# EAGLE design esp32programmer (EAGLE 9.5.2)
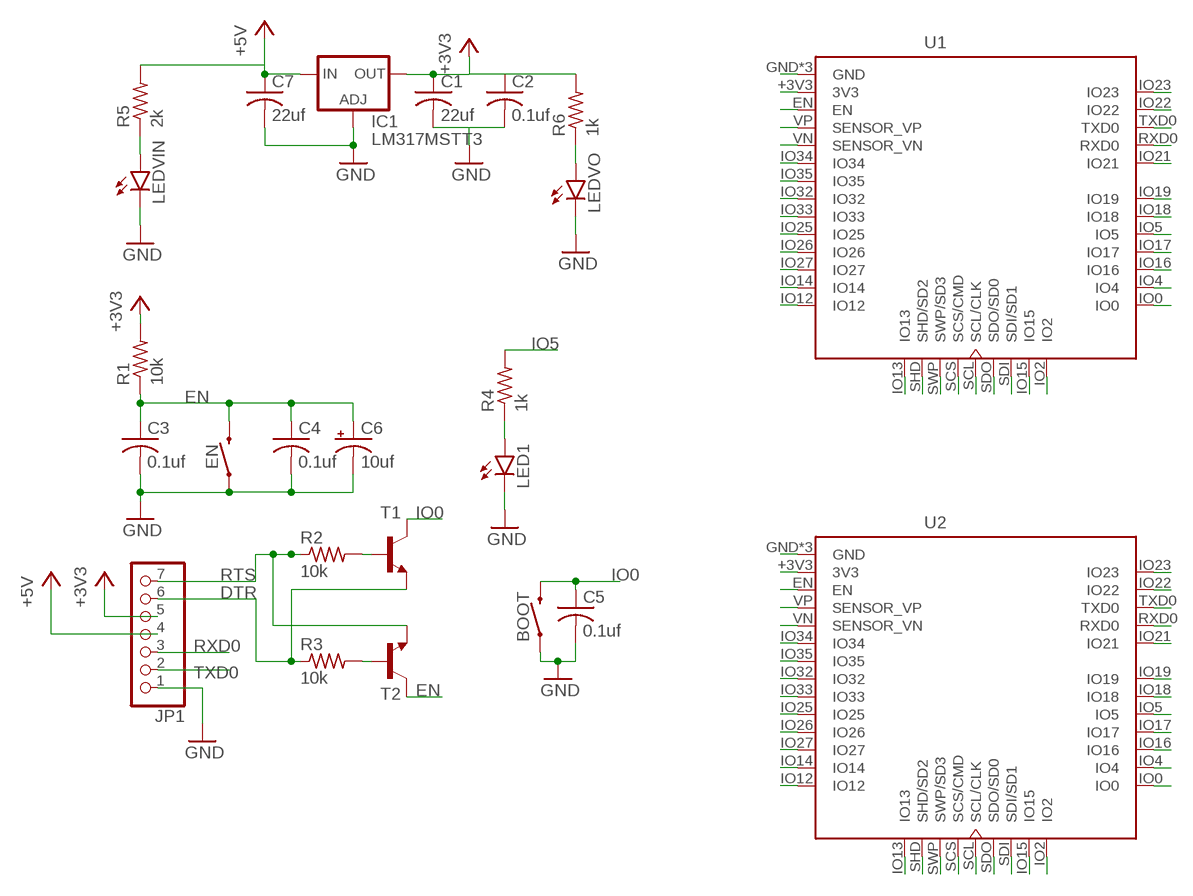
[diagram p0: schematic, sheet 1]

## Parts
BOOT  MOMENTARY-SWITCH-SPST-SMD-4.6X2.8MM  [TACTILE_SWITCH_SMD_4.6X2.8MM]
C1  22uf  C-USC1210  [C1210]
C2  0.1uf  C-USC0805  [C0805]
C3  0.1uf  C-USC0805  [C0805]
C4  0.1uf  C-USC0805  [C0805]
C5  0.1uf  C-USC0805  [C0805]
C6  10uf  CPOL-US153CLV-0605  [153CLV-0605]
C7  22uf  C-USC1210  [C1210]
EN  MOMENTARY-SWITCH-SPST-SMD-4.6X2.8MM  [TACTILE_SWITCH_SMD_4.6X2.8MM]
IC1  LM317MSTT3  [SOT223]
JP1  PINHD-1X7  [1X07]
LED1  LEDSML0805  [SML0805]
LEDVIN  LEDSML0805  [SML0805]
LEDVO  LEDSML0805  [SML0805]
R1  10k  R-US_R0805  [R0805]
R2  10k  R-US_M0805  [M0805]
R3  10k  R-US_M0805  [M0805]
R4  1k  R-US_R0805  [R0805]
R5  2k  R-US_R0805  [R0805]
R6  1k  R-US_R0805  [R0805]
T1  -NPN-SOT23-EBC  [SOT23-EBC]
T2  -NPN-SOT23-EBC  [SOT23-EBC]
U1  ESP32-32DADAPTOR  [ESP32_MODULE_ADAPTOR]
U2  ESP32-32DADAPTOR  [ESP32_MODULE_ADAPTOR]

## Nets
+3V3: C1.1 C2.1 IC1.4(OUT) JP1.5 R1.2 R6.2 U1.+3V3(3V3) U2.+3V3(3V3)
+5V: C7.1 IC1.3(IN) JP1.4 R5.2
DTR: JP1.6 R3.1 T1.E
EN: C3.1 C4.1 C6.+ EN.3 EN.4 R1.1 T2.C U1.EN U2.EN
GND: BOOT.1 BOOT.2 C1.2 C2.2 C3.2 C4.2 C5.2 C6.- C7.2 EN.1 EN.2 IC1.1(ADJ) JP1.1 LED1.C LEDVIN.C LEDVO.C U1.GND U1.GND@1(GND) U1.GND@3(GND) U2.GND U2.GND@1(GND) U2.GND@3(GND)
IO0: BOOT.3 BOOT.4 C5.1 T1.C U1.IO0 U2.IO0
IO2: U1.IO2 U2.IO2
IO4: U1.IO4 U2.IO4
IO5: R4.2 U1.IO5 U2.IO5
IO12: U1.IO12 U2.IO12
IO13: U1.IO13 U2.IO13
IO14: U1.IO14 U2.IO14
IO15: U1.IO15 U2.IO15
IO16: U1.IO16 U2.IO16
IO17: U1.IO17 U2.IO17
IO18: U1.IO18 U2.IO18
IO19: U1.IO19 U2.IO19
IO21: U1.IO21 U2.IO21
IO22: U1.IO22 U2.IO22
IO23: U1.IO23 U2.IO23
IO25: U1.IO25 U2.IO25
IO26: U1.IO26 U2.IO26
IO27: U1.IO27 U2.IO27
IO32: U1.IO32 U2.IO32
IO33: U1.IO33 U2.IO33
IO34: U1.IO34 U2.IO34
IO35: U1.IO35 U2.IO35
N$1: R2.2 T1.B
N$2: R3.2 T2.B
N$3: LED1.A R4.1
N$4: LEDVIN.A R5.1
N$5: LEDVO.A R6.1
RTS: JP1.7 R2.1 T2.E
RXD0: JP1.3 U1.RXD0 U2.RXD0
SCL: U1.SCL(SCL/CLK) U2.SCL(SCL/CLK)
SCS: U1.SCS(SCS/CMD) U2.SCS(SCS/CMD)
SDI: U1.SDI(SDI/SD1) U2.SDI(SDI/SD1)
SDO: U1.SDO(SDO/SD0) U2.SDO(SDO/SD0)
SHD: U1.SHD(SHD/SD2) U2.SHD(SHD/SD2)
SWP: U1.SWP(SWP/SD3) U2.SWP(SWP/SD3)
TXD0: JP1.2 U1.TXD0 U2.TXD0
VN: U1.VN(SENSOR_VN) U2.VN(SENSOR_VN)
VP: U1.VP(SENSOR_VP) U2.VP(SENSOR_VP)

## Library data of the parts
BOOT EN = SparkFun-Switches:MOMENTARY-SWITCH-SPST: Momentary Switch (Pushbutton) - SPST Normally-open (NO) SPST momentary switches (buttons, pushbuttons). Variants PTH-12MM - 12mm square, through-hole Momentary Pushbutton Switch - 12mm Square <https://www.sparkfun.com/products/9190> (COM-09190) PTH-6.0MM, PTH-6.0MM-KIT - 6.0mm square, through-hole Mini Pushbutton Switch <https://www.sparkfun.com/products/97> (COM-00097) KIT package intended for soldering kit's - only one side of pads' copper is exposed. PTH-RIGHT-ANGLE-KIT - Right-angle, through-hole Right Angle Tactile Button <https://www.sparkfun.com/products/10791> - Used on SparkFun BigTime Watch Kit <https://www.sparkfun.com/products/11734> SMD-12MM - 12mm square, surface-mount Tactile Button - SMD (12mm) <https://www.sparkfun.com/products/12993> (COM-12993) Used on SparkFun PicoBoard <https://www.sparkfun.com/products/11888> SMD-4.5MM - 4.5mm Square Trackball Switch Used on SparkFun Blackberry Trackballer Breakout <https://www.sparkfun.com/products/13169> SMD-4.6MMX2.8MM - 4.60mm x 2.80mm, surface mount Used on SparkFun SAMD21 Mini Breakout <https://www.sparkfun.com/products/13664> SMD-5.2MM, SMD-5.2-REDUNDANT - 5.2mm square, surface-mount Mini Pushbutton Switch - SMD <https://www.sparkfun.com/products/8720> (COM-08720) Used on Arduino Pro Mini <https://www.sparkfun.com/products/11114> REDUNDANT package connects both switch circuits together SMD-6.0X3.5MM - 6.0 x 3.5mm, surface mount Momentary Reset Switch SMD <https://www.sparkfun.com/products/8229> (COM-08229) SMD-6.2MM-TALL - 6.2mm square, surface mount Tactile Button - SMD (6mm) <https://www.sparkfun.com/products/12992> Used on SparkFun Digital Sandbox <https://www.sparkfun.com/products/12651> SMD-RIGHT-ANGLE - Right-angle, surface mount Used on SparkFun Block for Intel® Edison - Arduino <https://www.sparkfun.com/products/13036>; PROD_ID: SWCH-13065
C1-C5 C7 = rcl:C-US: CAPACITOR, American symbol; SPICEPREFIX: C
C6 = rcl:CPOL-US: POLARIZED CAPACITOR, American symbol; SPICEPREFIX: C
IC1 = v-reg:LM317?*: 500 mA Adjustable Output Positive Voltage Regulator Source: http://www.onsemi.co.jp .. LM317M-D.PDF
JP1 = pinhead:PINHD-1X7: PIN HEADER
LED1 LEDVIN LEDVO = led:LED: LED OSRAM: - CHIPLED LG R971, LG N971, LY N971, LG Q971, LY Q971, LO R971, LY R971 LH N974, LH R974 LS Q976, LO Q976, LY Q976 LO Q996 - Hyper CHIPLED LW Q18S LB Q993, LB Q99A, LB R99A - SideLED LS A670, LO A670, LY A670, LG A670, LP A670 LB A673, LV A673, LT A673, LW A673 LH A674 LY A675 LS A676, LA A676, LO A676, LY A676, LW A676 LS A679, LY A679, LG A679 - Hyper Micro SIDELED® LS Y876, LA Y876, LO Y876, LY Y876 LT Y87S - SmartLED LW L88C, LW L88S LB L89C, LB L89S, LG L890 LS L89K, LO L89K, LY L89K LS L896, LA L896, LO L896, LY L896 - TOPLED LS T670, LO T670, LY T670, LG T670, LP T670 LSG T670, LSP T670, LSY T670, LOP T670, LYG T670 LG T671, LOG T671, LSG T671 LB T673, LV T673, LT T673, LW T673 LH T674 LS T676, LA T676, LO T676, LY T676, LB T676, LH T676, LSB T676, LW T676 LB T67C, LV T67C, LT T67C, LS T67K, LO T67K, LY T67K, LW E67C LS E67B, LA E67B, LO E67B, LY E67B, LB E67C, LV E67C, LT E67C LW T67C LS T679, LY T679, LG T679 LS T770, LO T770, LY T770, LG T770, LP T770 LB T773, LV T773, LT T773, LW T773 LH T774 LS E675, LA E675, LY E675, LS T675 LS T776, LA T776, LO T776, LY T776, LB T776 LHGB T686 LT T68C, LB T68C - Hyper Mini TOPLED® LB M676 - Mini TOPLED Santana® LG M470 LS M47K, LO M47K, LY M47K Source: http://www.osram.convergy.de LUXEON: - LUMILED® LXK2-PW12-R00, LXK2-PW12-S00, LXK2-PW14-U00, LXK2-PW14-V00 LXK2-PM12-R00, LXK2-PM12-S00, LXK2-PM14-U00 LXK2-PE12-Q00, LXK2-PE12-R00, LXK2-PE12-S00, LXK2-PE14-T00, LXK2-PE14-U00 LXK2-PB12-K00, LXK2-PB12-L00, LXK2-PB12-M00, LXK2-PB14-N00, LXK2-PB14-P00, LXK2-PB14-Q00 LXK2-PR12-L00, LXK2-PR12-M00, LXK2-PR14-Q00, LXK2-PR14-R00 LXK2-PD12-Q00, LXK2-PD12-R00, LXK2-PD12-S00 LXK2-PH12-R00, LXK2-PH12-S00 LXK2-PL12-P00, LXK2-PL12-Q00, LXK2-PL12-R00 Source: www.luxeon.com KINGBRIGHT: KA-3528ASYC Source: www.kingbright.com
R1-R6 = rcl:R-US_: RESISTOR, American symbol; SPICEPREFIX: R
T1 T2 = transistor:*-NPN-: NPN Transistror BF959 corrected 2008.03.06
U1 U2 = CustomParts:ESP32-32D: IC: SoC; GPIO, I2C, I2S, IR, SD, SDIO, SPI, UART; 2.7÷3.6VDC; 20dBm

## Board
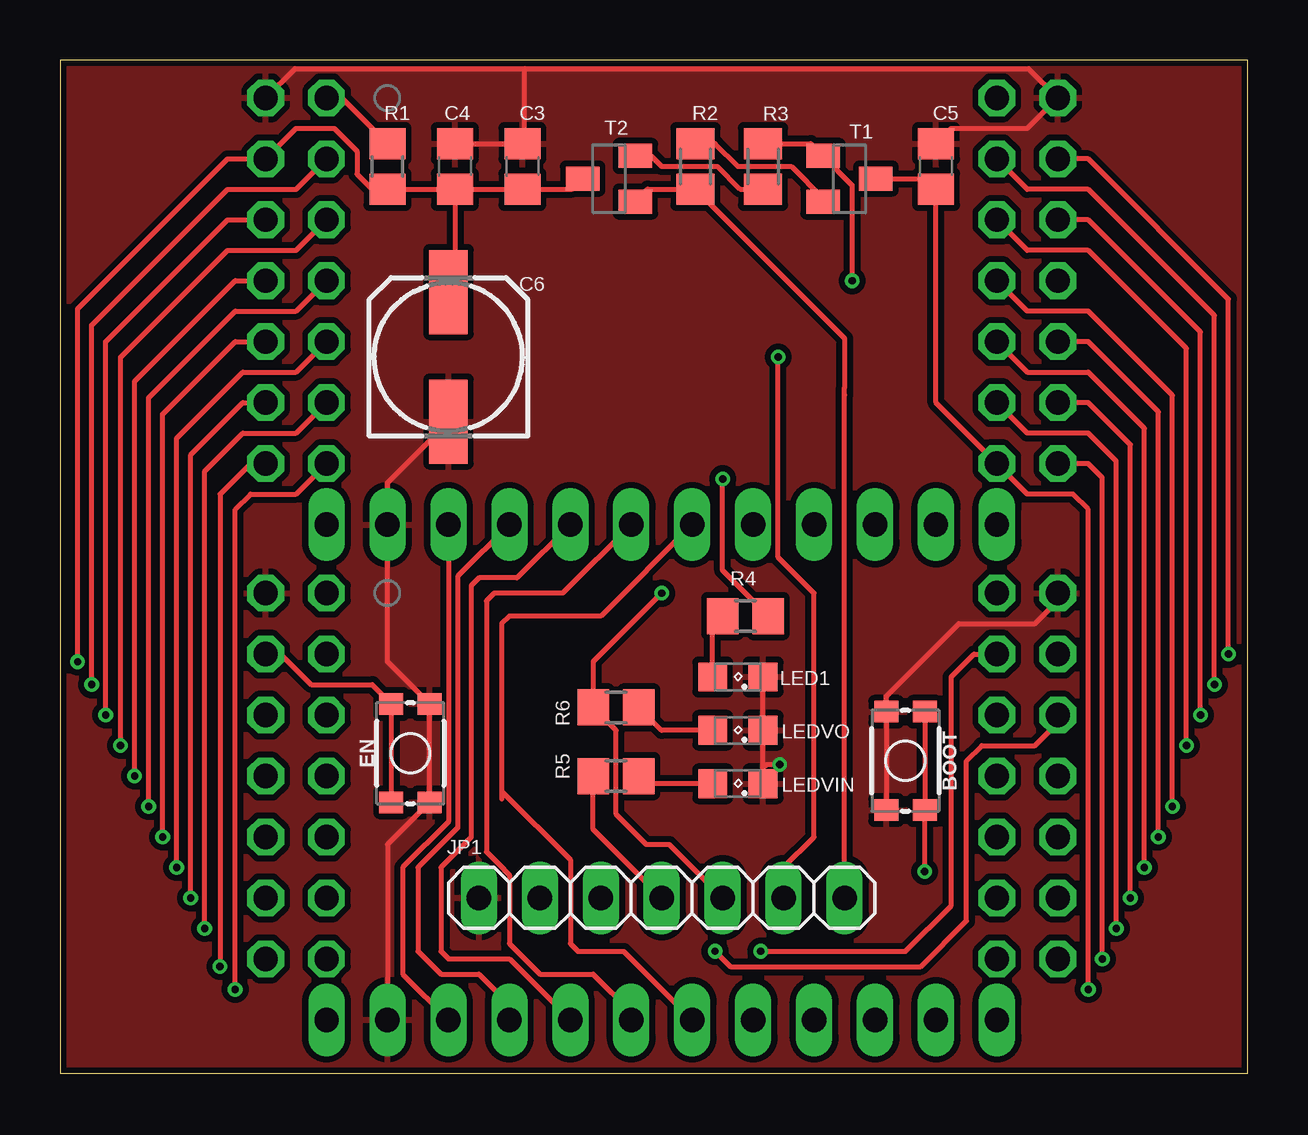
[diagram p1: board, top side]
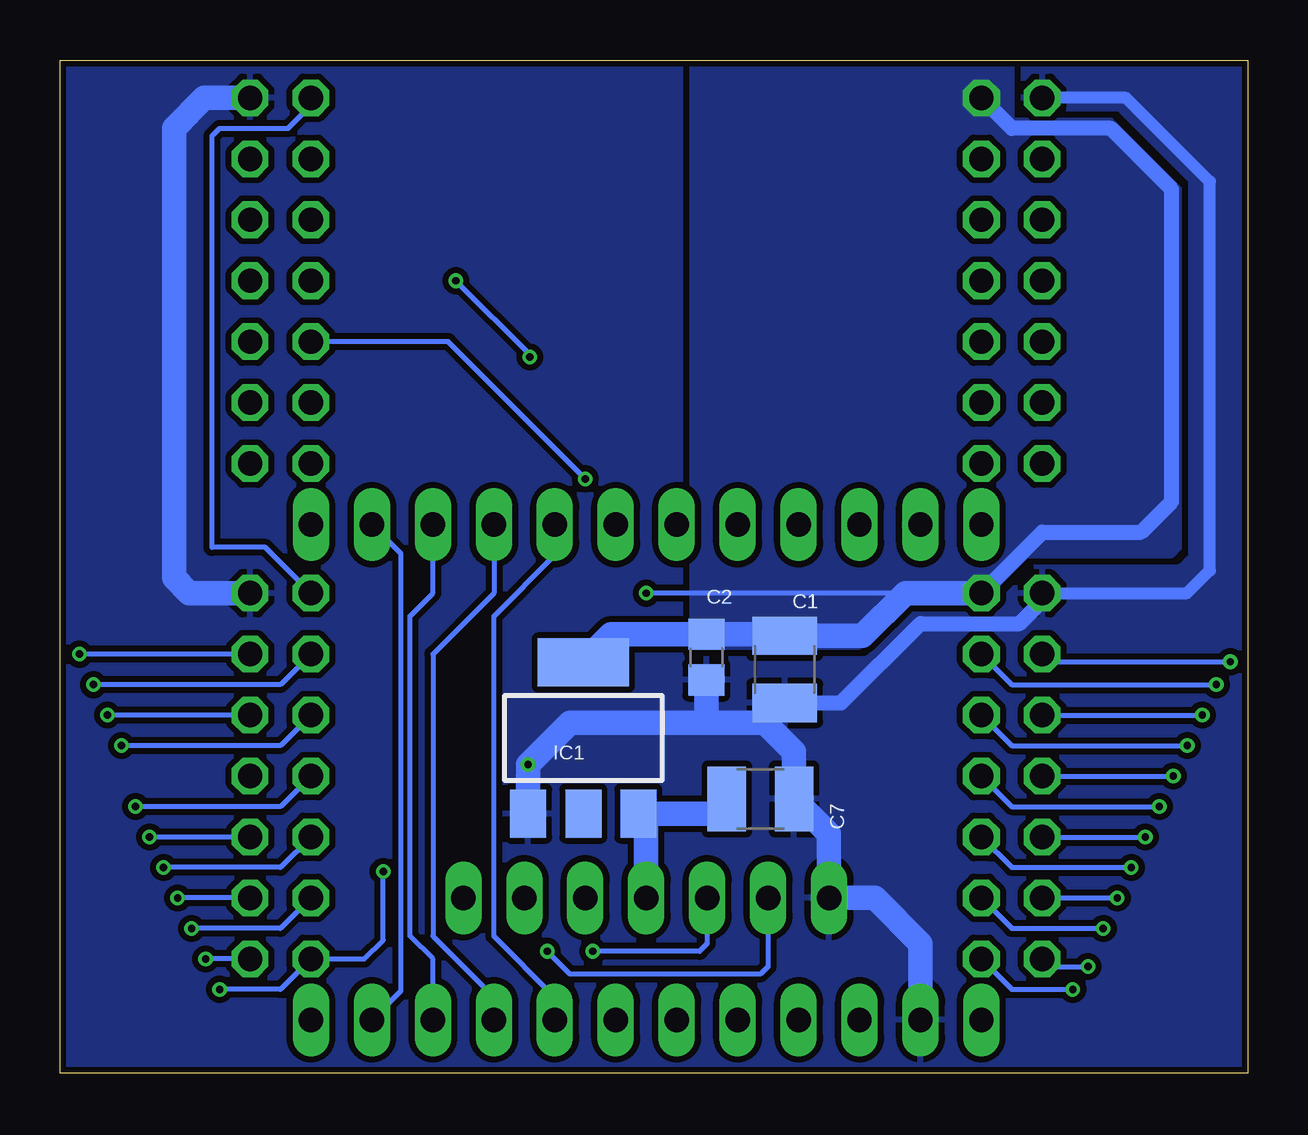
[diagram p2: board, bottom side, seen from below]

Size 49.52 x 42.22 mm. Coordinates in mm from the lower left corner, seen from the top.
Outline: 0,0 49.52,0 49.52,42.22 0,42.22 0,0
Copper layers (1*16): Top 0.035mm / dielectric 1.5mm / Bottom 0.035mm
Design rules "dirt_cheap_dirty_boards.v1.1 *": minimum track width 6mil, minimum drill 12mil, track to track 7mil, track to pad 7mil, pad to pad 7mil, via to via 7mil, smd to smd 0mil, copper to edge 10mil, drill to drill 10mil, minimum pad ring 10mil, minimum via ring 6mil, stop-mask expansion 2mil, vias tented up to drill 25mil, thermal gap 10mil

### Footprints (pad centres in the part's own frame; a part is rotated, then mirrored left to right if it is on the bottom)
TACTILE_SWITCH_SMD_4.6X2.8MM = smd 0.9 x 1: 1 -2.05,-0.8; 2 2.05,-0.8; 3 2.05,0.8; 4 -2.05,0.8
C1210 = smd 1.6 x 2.7: 1 -1.4,0; 2 1.4,0
C0805 = smd 1.3 x 1.5: 1 -0.95,0; 2 0.95,0
153CLV-0605 = smd 3.5 x 1.6: + 2.7,0; - -2.7,0
SOT223 = smd 1.5 x 2: 1 -2.3,-3.15; 2 0,-3.15; 3 2.3,-3.15 | smd 3.8 x 2: 4 0,3.15
1X07 = drill 1.016 long: 1 -7.62,0; 2 -5.08,0; 3 -2.54,0; 4 0,0; 5 2.54,0; 6 5.08,0; 7 7.62,0
SML0805 = smd 1.2 x 1.2: A 1.05,0; C -1.05,0
R0805 = smd 1.3 x 1.5: 1 -0.95,0; 2 0.95,0
M0805 = smd 1.3 x 1.6: 1 -0.95,0; 2 0.95,0
SOT23-EBC = smd 1 x 1.4: B 0.95,-1.1; C 0,1.1; E -0.95,-1.1
ESP32_MODULE_ADAPTOR = drill 1.016 octagon: +3V3 -13.97,8.89; EN -16.51,6.35; GND -16.51,8.89; GND@3 16.51,8.89; IO0 13.97,-6.35; IO4 16.51,-6.35; IO5 13.97,-1.27; IO12 -13.97,-6.35; IO14 -16.51,-6.35; IO16 13.97,-3.81; IO17 16.51,-3.81; IO18 16.51,-1.27; IO19 13.97,1.27; IO21 13.97,3.81; IO22 16.51,6.35; IO23 13.97,8.89; IO25 -13.97,-1.27; IO26 -16.51,-3.81; IO27 -13.97,-3.81; IO32 -13.97,1.27; IO33 -16.51,-1.27; IO34 -13.97,3.81; IO35 -16.51,1.27; NC@7 16.51,1.27; RXD0 16.51,3.81; TXD0 13.97,6.35; VN -16.51,3.81; VP -13.97,6.35 | drill 1.016 long: GND@1 -11.43,-8.89; IO2 11.43,-8.89; IO13 -8.89,-8.89; IO15 8.89,-8.89; NC@29 -13.97,-8.89; NC@40 13.97,-8.89; SCL 1.27,-8.89; SCS -1.27,-8.89; SDI 6.35,-8.89; SDO 3.81,-8.89; SHD -6.35,-8.89; SWP -3.81,-8.89

### Placement (x,y rotation side)
BOOT  35.24,13.02 270 top
C1  19.31,16.83 270 bottom
C2  22.57,17.34 270 bottom
C3  19.28,37.78 90 top
C4  16.47,37.78 90 top
C5  36.51,37.78 90 top
C6  16.19,29.84 90 top
C7  20.32,11.43 0 bottom
EN  14.61,13.34 90 top
IC1  27.7,13.97 0 bottom
JP1  25.08,7.3 0 top
LED1  28.26,16.51 180 top
LEDVIN  28.26,12.07 180 top
LEDVO  28.26,14.29 180 top
R1  13.65,37.78 90 top
R2  26.49,37.78 90 top
R3  29.3,37.78 270 top
R4  28.57,19.05 0 top
R5  23.18,12.38 180 top
R6  23.18,15.24 180 top
T1  32.91,37.27 270 top
T2  22.88,37.27 90 top
U1  25.08,11.11 0 top
U2  25.08,31.75 0 top

### Tracks (layer width: path | path; a pad name or v marks a point on that pad's centre or on a via)
+3V3  (via drill 0.3)
  Top 0.203: JP1.5 25.4,9.52 24.45,9.52 23.18,10.79 23.18,14.29 R6.2 22.23,17.15 v25.08,20 | R1.2 11.74,40.64 U2.+3V3
  Bottom 0.203: 14.29,20 v25.08,20
  Bottom 0.635: U2.+3V3 9.84,39.37 5.71,39.37 3.17,36.83 3.17,23.81 4.44,22.54 8.57,22.54 U1.+3V3
  Bottom 1.016: IC1.4 26.54,18.29 C2.1 19.37,18.29 C1.1 16.06,18.23 14.29,20 U1.+3V3
  pour Bottom (isolate 0.254, no thermals): 9.53,42.23 23.18,42.23 23.18,17.78 16.19,17.78 14.29,19.69 11.11,19.69 9.21,21.59 3.18,21.59 2.86,21.91 2.86,36.83 5.71,39.69 9.84,39.69 9.84,41.91
+5V
  Top 0.203: JP1.4 22.23,10.16 R5.2
  Bottom 1.016: JP1.4 25.08,10.5 IC1.3 22.33,10.82 C7.1
DTR  (via drill 0.3)
  Top 0.203: R3.1 31.3,38.73 T1.E 33.02,37.01 v33.02,33.02 | JP1.6 30.16,8.57 31.43,9.84 31.43,20 29.93,21.5 v29.93,29.84
  Bottom 0.203: v33.02,33.02 29.93,29.93 v29.93,29.84
EN  (via drill 0.3)
  Top 0.203: v0.74,17.14 0.74,31.85 6.99,38.1 U2.EN 9.84,39.37 11.43,39.37 12.38,38.42 12.38,37.47 13.02,36.83 R1.1 C4.1 | U1.EN 9.21,17.46 10.48,16.19 13.02,16.19 13.81,15.41 EN.3 EN.4 | C4.1 C3.1 21.35,36.83 T2.C | C4.1 16.47,32.82 C6.+
  Bottom 0.203: U1.EN 8.26,17.14 v0.74,17.14
GND  (via drill 0.3)
  Top 0.203: BOOT.2 BOOT.1 34.44,15.71 37.46,18.73 40.64,18.73 41.59,19.69 U1.GND@3 | U1.GND@1 13.65,9.53 EN.1 EN.2 13.65,17.14 U2.GND@1 13.65,24.6 C6.- | U2.GND 9.79,41.86 19.37,41.86 | 19.37,41.86 40.37,41.86 U2.GND@3 40.32,39.37 37.15,39.37 C5.2 | 29.31,12.7 LEDVIN.C 29.31,12.16 | 29.31,12.7 LEDVO.C LED1.C | v30,12.86 29.47,12.86 29.31,12.7 | C4.2 C3.2 19.37,38.82 19.37,41.86
  Bottom 0.508: U1.GND 2.54,20 1.59,20.96 1.59,37.15 5.08,40.64 U2.GND
  Bottom 0.635: C1.2 16.96,15.43 13.65,18.73 9.53,18.73 8.57,19.69 U1.GND
  Bottom 1.016: U1.GND@3 44.13,20 44.77,20.64 44.77,39.37 43.5,40.64 U2.GND@3 | IC1.1 v30,12.86 28.26,14.6 22.54,14.6 | 20.13,14.6 C1.2 | 22.54,14.6 20.13,14.6 | C2.2 22.57,14.63 22.54,14.6 | 20.13,14.6 18.92,13.39 C7.2 17.46,9.97 JP1.1 15.56,7.3 13.65,5.4 U1.GND@1
  pour Bottom (isolate 0.254, rank 5): 0,42.23 49.53,42.23 49.53,0 0,0
  pour Top (isolate 0.254): 0,42.23 49.53,42.23 49.53,0 0,0
IO0  (via drill 0.3)
  Top 0.203: v42.86,3.49 42.86,23.5 42.23,24.13 40.32,24.13 U2.IO0 36.51,27.94 C5.1 36.07,37.27 T1.C | BOOT.4 BOOT.3 v36.04,8.41
  Bottom 0.203: v42.86,3.49 40.32,3.49 U1.IO0 36.83,4.76 36.04,5.55 v36.04,8.41
IO2
  Bottom 0.203: U1.IO2 35.31,3.43 35.31,21.65 U2.IO2
IO4  (via drill 0.3)
  Top 0.203: v43.45,4.76 43.45,24.82 42.86,25.4 U2.IO4
  Bottom 0.203: U1.IO4 v43.45,4.76
IO5  (via drill 0.3)
  Top 0.203: v45.2,8.57 45.2,26.87 42.86,29.21 40.32,29.21 U2.IO5 | R4.2 27.62,20.95 v27.62,24.76
  Bottom 0.203: U1.IO5 40.32,8.57 v45.2,8.57 | v27.62,24.76 33.34,30.48 U2.IO5
IO12  (via drill 0.3)
  Top 0.203: v7.3,3.49 7.3,23.5 7.94,24.13 9.84,24.13 U2.IO12
  Bottom 0.203: U1.IO12 9.84,3.49 v7.3,3.49
IO13
  Top 0.203: U2.IO13 16.19,10.48 14.29,8.57 14.29,4.13 U1.IO13
IO14  (via drill 0.3)
  Top 0.203: v6.67,4.45 6.67,24.13 7.94,25.4 U2.IO14
  Bottom 0.203: U1.IO14 8.26,4.45 v6.67,4.45
IO15
  Bottom 0.203: U1.IO15 33.97,4.76 34.92,5.72 34.92,19.05 33.97,20 U2.IO15
IO16  (via drill 0.3)
  Top 0.203: v44.03,6.03 44.03,25.5 42.86,26.67 40.32,26.67 U2.IO16
  Bottom 0.203: v44.03,6.03 40.32,6.03 U1.IO16
IO17  (via drill 0.3)
  Top 0.203: v44.62,7.3 44.62,26.19 42.86,27.94 U2.IO17
  Bottom 0.203: U1.IO17 v44.62,7.3
IO18  (via drill 0.3)
  Top 0.203: v45.78,9.84 45.78,27.56 42.86,30.48 U2.IO18
  Bottom 0.203: U1.IO18 v45.78,9.84
IO19  (via drill 0.3)
  Top 0.203: v46.37,11.11 46.37,28.24 42.86,31.75 40.32,31.75 U2.IO19
  Bottom 0.203: U1.IO19 40.32,11.11 v46.37,11.11
IO21  (via drill 0.3)
  Top 0.203: v46.95,13.65 46.95,30.2 42.86,34.29 40.32,34.29 U2.IO21
  Bottom 0.203: U1.IO21 40.32,13.65 v46.95,13.65
IO22  (via drill 0.3)
  Top 0.203: v48.7,17.46 48.7,32.26 42.86,38.1 U2.IO22
  Bottom 0.203: U1.IO22 v48.7,17.46
IO23
  Bottom 0.203: U1.IO23 40.96,21.91 43.18,21.91 43.18,39.05 42.86,39.37 40,39.37 39.05,40.32 U2.IO23
IO25  (via drill 0.3)
  Top 0.203: v4.86,8.57 4.86,26.45 7.62,29.21 9.84,29.21 U2.IO25
  Bottom 0.203: U1.IO25 9.84,8.57 v4.86,8.57
IO26  (via drill 0.3)
  Top 0.203: v5.45,7.3 5.45,25.77 7.62,27.94 U2.IO26
  Bottom 0.203: U1.IO26 v5.45,7.3
IO27  (via drill 0.3)
  Top 0.203: v6.03,6.03 6.03,25.08 7.62,26.67 9.84,26.67 U2.IO27
  Bottom 0.203: U1.IO27 9.84,6.03 v6.03,6.03
IO32  (via drill 0.3)
  Top 0.203: v3.7,11.11 3.7,28.14 7.3,31.75 9.84,31.75 U2.IO32
  Bottom 0.203: U1.IO32 9.84,11.11 v3.7,11.11
IO33  (via drill 0.3)
  Top 0.203: v4.28,9.84 4.28,27.46 7.3,30.48 U2.IO33
  Bottom 0.203: U1.IO33 v4.28,9.84
IO34  (via drill 0.3)
  Top 0.203: v2.53,13.65 2.53,29.83 6.99,34.29 9.84,34.29 U2.IO34
  Bottom 0.203: U1.IO34 9.84,13.65 v2.53,13.65
IO35  (via drill 0.3)
  Top 0.203: v3.11,12.38 3.11,28.83 7.3,33.02 U2.IO35
  Bottom 0.203: U1.IO35 v3.11,12.38
N$1
  Top 0.203: R2.2 27.31,38.73 28.26,37.78 30.48,37.78 31.81,36.45 T1.B
N$2
  Top 0.203: T2.B 24.64,38.22 25.08,37.78 27.4,37.78 28.35,36.83 R3.2
N$3
  Top 0.203: LED1.A 27.21,18.63 R4.1
N$4
  Top 0.203: LEDVIN.A 24.45,12.07 R5.1
N$5
  Top 0.203: LEDVO.A 25.08,14.29 R6.1
RTS
  Top 0.203: T2.E 24.5,36.83 R2.1 32.7,30.62 32.7,28.57 32.7,28.26 JP1.7
RXD0  (via drill 0.3)
  Top 0.203: v47.54,14.92 47.54,30.89 42.86,35.56 U2.RXD0 | v27.31,5.08 27.94,4.45 35.88,4.45 37.78,6.35 37.78,13.02 38.42,13.65 40.64,13.65 41.59,14.6 U1.RXD0
  Bottom 0.203: U1.RXD0 v47.54,14.92 | JP1.3 22.54,5.4 22.86,5.08 v27.31,5.08
SCL
  Top 0.203: U2.SCL 22.54,19.05 18.73,19.05 18.42,18.73 18.42,11.75 | 18.42,11.75 18.42,11.43 | 18.42,11.75 21.27,8.89 21.27,5.4 21.59,5.08 23.49,5.08 U1.SCL
SCS
  Top 0.203: U2.SCS 20.96,20 18.1,20 17.78,19.69 17.78,9.22 18.5,8.5 18.5,8.48 18.73,8.26 18.73,5.4 20,4.13 22.23,4.13 23.81,2.54 U1.SCS
SDI
  Bottom 0.203: U2.SDI 31.43,20 33.97,17.46 33.97,5.72 31.43,3.18 U1.SDI
SDO
  Bottom 0.203: U1.SDO 28.89,3.18 31.43,5.72 31.43,19.05 28.89,21.59 U2.SDO
SHD
  Top 0.203: U2.SHD 16.57,20.7 16.57,10.22 14.92,8.57 14.92,5.08 15.88,4.13 17.46,4.13 18.73,2.86 U1.SHD
SWP
  Top 0.203: U2.SWP 19.05,20.64 17.46,20.64 17.14,20.32 17.14,9.84 15.88,8.57 15.88,5.08 16.19,4.76 18.73,4.76 U1.SWP
TXD0  (via drill 0.3)
  Top 0.203: v48.12,16.19 48.12,31.57 42.86,36.83 40.32,36.83 U2.TXD0 | v29.21,5.08 35.24,5.08 37.15,6.98 37.15,16.51 38.1,17.46 U1.TXD0
  Bottom 0.203: U1.TXD0 40.32,16.19 v48.12,16.19 | JP1.2 20,4.45 20.32,4.13 28.26,4.13 v29.21,5.08
VN  (via drill 0.3)
  Top 0.203: v1.9,14.92 1.9,30.48 6.99,35.56 U2.VN
  Bottom 0.203: U1.VN v1.9,14.92
VP  (via drill 0.3)
  Top 0.203: v1.32,16.19 1.32,31.17 6.99,36.83 9.84,36.83 U2.VP
  Bottom 0.203: U1.VP 9.84,16.19 v1.32,16.19